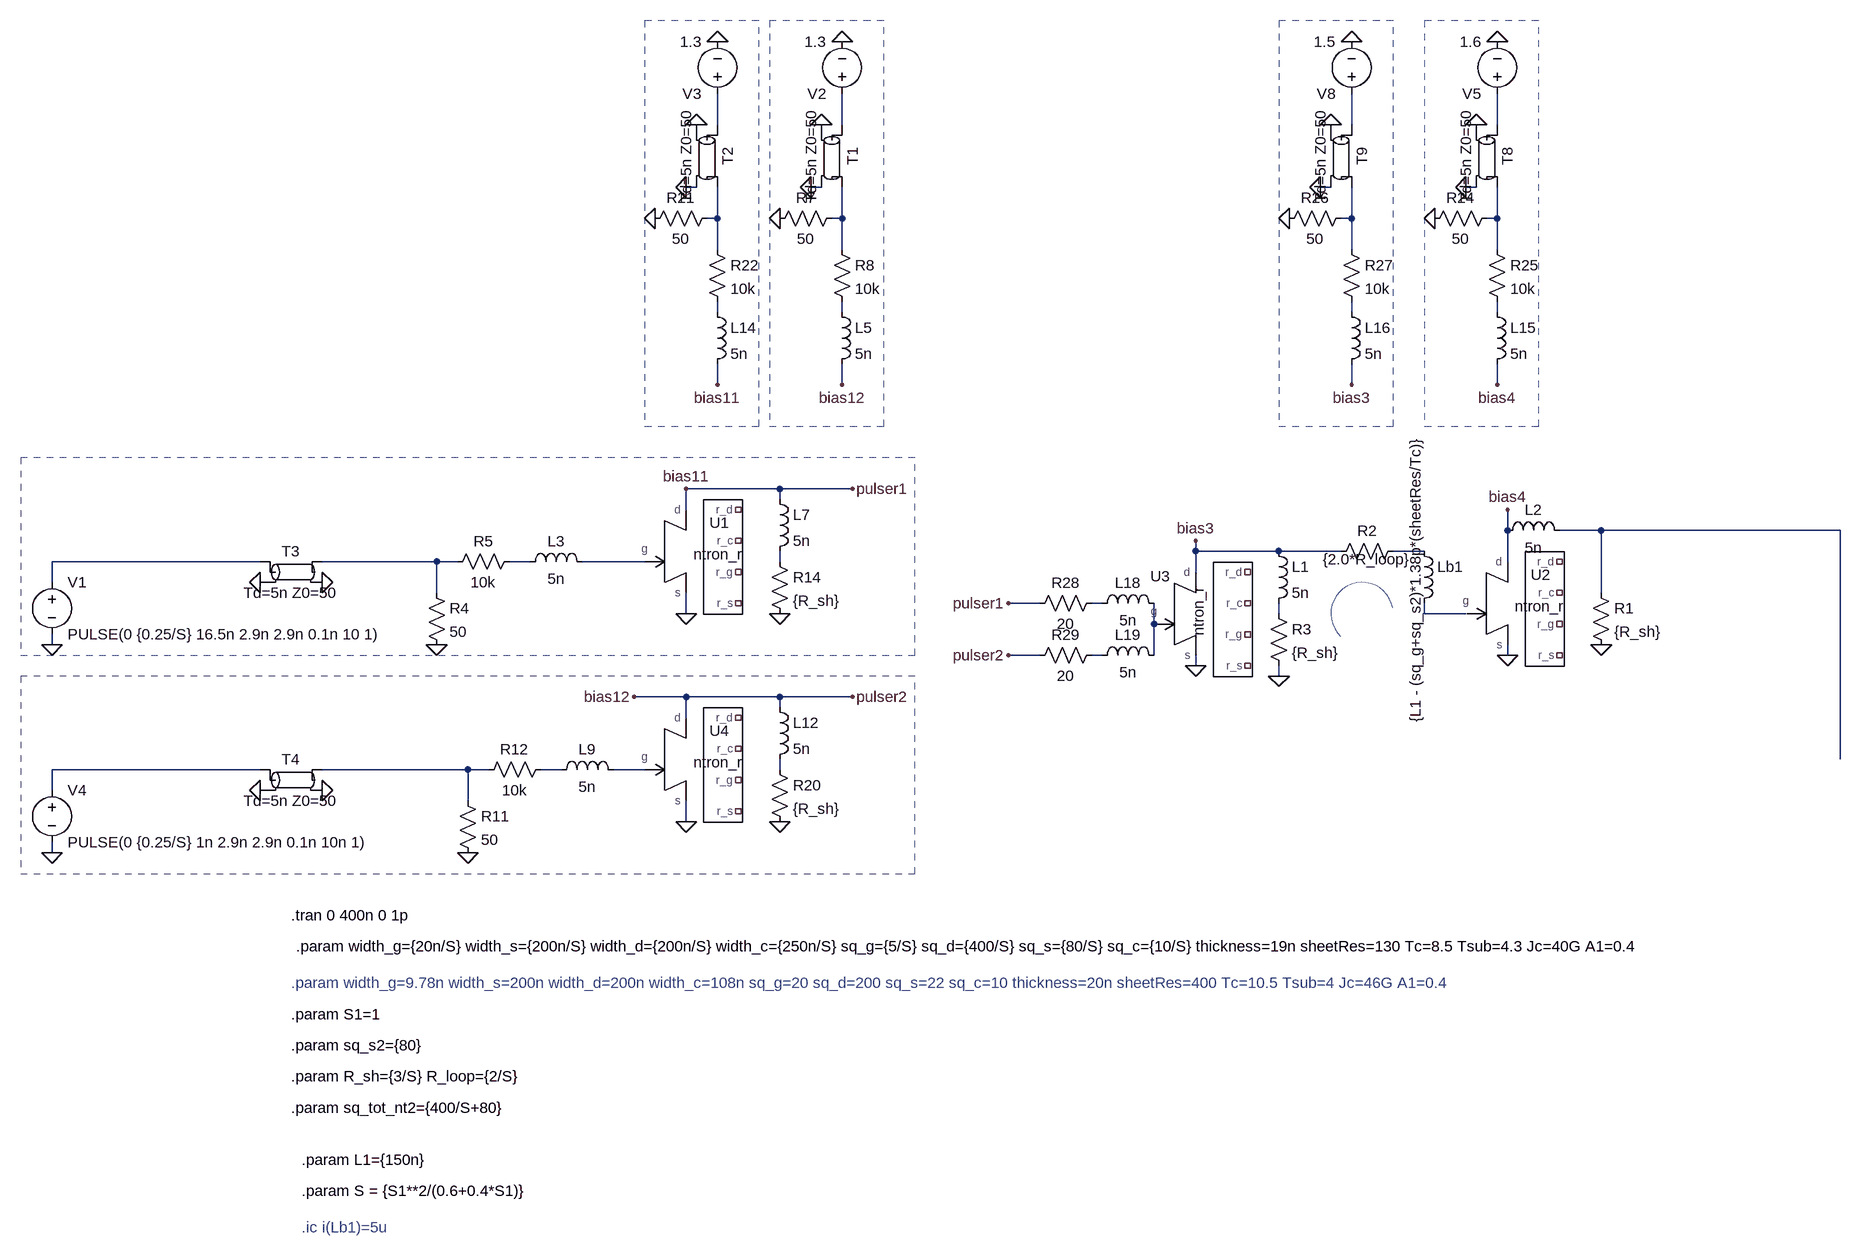
[diagram p0: schematic SNN_2input_single_transponder.asc]
SNN_2input_single_transponder.asc, the LTspice schematic file:
Version 4.1
SHEET 1 3684 2036
WIRE -1920 -1168 -1920 -1216
WIRE -1728 -1168 -1728 -1216
WIRE -944 -1168 -944 -1216
WIRE -720 -1168 -720 -1216
WIRE -1952 -1072 -1968 -1072
WIRE -1760 -1072 -1776 -1072
WIRE -976 -1072 -992 -1072
WIRE -752 -1072 -768 -1072
WIRE -1920 -1024 -1920 -1072
WIRE -1920 -1024 -1936 -1024
WIRE -1728 -1024 -1728 -1072
WIRE -1728 -1024 -1744 -1024
WIRE -944 -1024 -944 -1072
WIRE -944 -1024 -960 -1024
WIRE -720 -1024 -720 -1072
WIRE -720 -1024 -736 -1024
WIRE -1920 -976 -1920 -1024
WIRE -1728 -976 -1728 -1024
WIRE -944 -976 -944 -1024
WIRE -720 -976 -720 -1024
WIRE -1920 -880 -1920 -896
WIRE -1728 -880 -1728 -896
WIRE -944 -880 -944 -896
WIRE -720 -880 -720 -896
WIRE -1920 -768 -1920 -800
WIRE -1728 -768 -1728 -800
WIRE -944 -768 -944 -800
WIRE -720 -768 -720 -800
WIRE -1824 -608 -1968 -608
WIRE -1712 -608 -1824 -608
WIRE -1824 -592 -1824 -608
WIRE -1968 -576 -1968 -608
WIRE -704 -544 -704 -576
WIRE -560 -544 -624 -544
WIRE -192 -544 -560 -544
WIRE -1184 -512 -1184 -528
WIRE -1056 -512 -1184 -512
WIRE -960 -512 -1056 -512
WIRE -832 -512 -880 -512
WIRE -2624 -496 -2944 -496
WIRE -2352 -496 -2528 -496
WIRE -2320 -496 -2352 -496
WIRE -2208 -496 -2240 -496
WIRE -2032 -496 -2128 -496
WIRE -1824 -496 -1824 -512
WIRE -704 -496 -704 -544
WIRE -1184 -480 -1184 -512
WIRE -2944 -464 -2944 -496
WIRE -2352 -448 -2352 -496
WIRE -560 -448 -560 -544
WIRE -1424 -432 -1472 -432
WIRE -1328 -432 -1344 -432
WIRE -1968 -416 -1968 -448
WIRE -1056 -416 -1056 -432
WIRE -832 -416 -832 -432
WIRE -768 -416 -832 -416
WIRE -1248 -400 -1248 -432
WIRE -2944 -368 -2944 -384
WIRE -1424 -352 -1472 -352
WIRE -1328 -352 -1344 -352
WIRE -1248 -352 -1248 -400
WIRE -704 -352 -704 -368
WIRE -1184 -336 -1184 -352
WIRE -1056 -320 -1056 -336
WIRE -1968 -288 -2048 -288
WIRE -1824 -288 -1968 -288
WIRE -1712 -288 -1824 -288
WIRE -1824 -272 -1824 -288
WIRE -1968 -256 -1968 -288
WIRE -192 -192 -192 -544
WIRE -2624 -176 -2944 -176
WIRE -2304 -176 -2528 -176
WIRE -2272 -176 -2304 -176
WIRE -2160 -176 -2192 -176
WIRE -2032 -176 -2080 -176
WIRE -1824 -176 -1824 -192
WIRE -2944 -144 -2944 -176
WIRE -2304 -128 -2304 -176
WIRE -1968 -96 -1968 -128
WIRE -2944 -48 -2944 -64
FLAG -704 -352 0
FLAG -1056 -320 0
FLAG -2352 -368 0
FLAG -2944 -368 0
FLAG -2528 -464 0
FLAG -2624 -464 0
FLAG -1968 -416 0
FLAG -1824 -416 0
FLAG -2304 -48 0
FLAG -2944 -48 0
FLAG -2528 -144 0
FLAG -2624 -144 0
FLAG -1184 -336 0
FLAG -1968 -96 0
FLAG -1824 -96 0
FLAG -1712 -608 pulser1
FLAG -1712 -288 pulser2
FLAG -2048 -288 bias12
FLAG -816 -1024 0
FLAG -752 -1168 0
FLAG -768 -1072 0
FLAG -720 -1296 0
FLAG -720 -768 bias4
FLAG -1040 -1024 0
FLAG -976 -1168 0
FLAG -992 -1072 0
FLAG -944 -1296 0
FLAG -944 -768 bias3
FLAG -1184 -528 bias3
FLAG -704 -576 bias4
FLAG -560 -368 0
FLAG -1824 -1024 0
FLAG -1760 -1168 0
FLAG -1776 -1072 0
FLAG -1728 -1296 0
FLAG -1728 -768 bias12
FLAG -2016 -1024 0
FLAG -1952 -1168 0
FLAG -1968 -1072 0
FLAG -1920 -1296 0
FLAG -1920 -768 bias11
FLAG -1968 -608 bias11
FLAG -1472 -432 pulser1
FLAG -1472 -352 pulser2
SYMBOL ind -848 -528 R0
WINDOW 3 2 -165 VRight 2
SYMATTR Value {L1 - (sq_g+sq_s2)*1.38p*(sheetRes/Tc)}
SYMATTR InstName Lb1
SYMBOL ntron_r -704 -432 R0
WINDOW 39 2 131 Invisible 2
WINDOW 3 50 -11 Top 2
WINDOW 0 51 -28 Bottom 2
SYMATTR SpiceLine width_g={width_g} width_s={width_s} width_d={width_d} width_c={width_c} sq_g={sq_g} sq_d={sq_tot_nt2-sq_s2} sq_s={sq_s2} sq_c={sq_c} thickness={thickness} sheetRes={sheetRes} Tc={Tc} Tsub={Tsub} Jc={Jc} A1={A1}
SYMATTR InstName U2
SYMBOL res -1072 -432 R0
SYMATTR InstName R3
SYMATTR Value {R_sh}
SYMBOL ind -1072 -528 R0
SYMATTR InstName L1
SYMATTR Value 5n
SYMBOL res -2368 -464 R0
SYMATTR InstName R4
SYMATTR Value 50
SYMBOL res -2336 -480 R270
WINDOW 0 32 56 VTop 2
WINDOW 3 0 56 VBottom 2
SYMATTR InstName R5
SYMATTR Value 10k
SYMBOL ind -2224 -480 R270
WINDOW 0 32 56 VTop 2
WINDOW 3 5 56 VBottom 2
SYMATTR InstName L3
SYMATTR Value 5n
SYMBOL voltage -2944 -480 R0
WINDOW 123 0 0 Left 2
WINDOW 39 0 0 Left 2
SYMATTR InstName V1
SYMATTR Value PULSE(0 {0.25/S} 16.5n 2.9n 2.9n 0.1n 10 1)
SYMBOL tline -2576 -480 R0
SYMATTR InstName T3
SYMATTR Value Td=5n Z0=50
SYMBOL res -976 -496 R270
WINDOW 0 32 56 VTop 2
WINDOW 3 19 56 VBottom 2
SYMATTR InstName R2
SYMATTR Value {2.0*R_loop}
SYMBOL ntron_r -1184 -416 R0
WINDOW 39 2 131 Invisible 2
WINDOW 3 20 -4 VBottom 2
WINDOW 0 -54 -42 Bottom 2
SYMATTR SpiceLine width_g={width_g} width_s={width_s} width_d={width_d} width_c={width_c} sq_g=10 sq_d={sq_d} sq_s={sq_s} sq_c={sq_c} thickness={thickness} sheetRes={sheetRes} Tc={Tc} Tsub={Tsub} Jc={Jc} A1={A1}
SYMATTR InstName U3
SYMBOL res -1840 -512 R0
SYMATTR InstName R14
SYMATTR Value {R_sh}
SYMBOL ind -1840 -608 R0
SYMATTR InstName L7
SYMATTR Value 5n
SYMBOL ntron_r -1968 -512 R0
WINDOW 39 2 131 Invisible 2
WINDOW 3 50 -11 Top 2
WINDOW 0 51 -28 Bottom 2
SYMATTR SpiceLine width_g={width_g} width_s={width_s} width_d={width_d} width_c={width_c} sq_g=10 sq_d={sq_d} sq_s={sq_s} sq_c={sq_c} thickness={thickness} sheetRes={sheetRes} Tc={Tc} Tsub={Tsub} Jc={Jc} A1={A1}
SYMATTR InstName U1
SYMBOL res -2320 -144 R0
SYMATTR InstName R11
SYMATTR Value 50
SYMBOL res -2288 -160 R270
WINDOW 0 32 56 VTop 2
WINDOW 3 0 56 VBottom 2
SYMATTR InstName R12
SYMATTR Value 10k
SYMBOL ind -2176 -160 R270
WINDOW 0 32 56 VTop 2
WINDOW 3 5 56 VBottom 2
SYMATTR InstName L9
SYMATTR Value 5n
SYMBOL voltage -2944 -160 R0
WINDOW 123 0 0 Left 2
WINDOW 39 0 0 Left 2
SYMATTR InstName V4
SYMATTR Value PULSE(0 {0.25/S} 1n 2.9n 2.9n 0.1n 10n 1)
SYMBOL tline -2576 -160 R0
SYMATTR InstName T4
SYMATTR Value Td=5n Z0=50
SYMBOL res -1840 -192 R0
SYMATTR InstName R20
SYMATTR Value {R_sh}
SYMBOL ind -1840 -288 R0
SYMATTR InstName L12
SYMATTR Value 5n
SYMBOL ntron_r -1968 -192 R0
WINDOW 39 2 131 Invisible 2
WINDOW 3 50 -11 Top 2
WINDOW 0 51 -28 Bottom 2
SYMATTR SpiceLine width_g={width_g} width_s={width_s} width_d={width_d} width_c={width_c} sq_g=10 sq_d={sq_d} sq_s={sq_s} sq_c={sq_c} thickness={thickness} sheetRes={sheetRes} Tc={Tc} Tsub={Tsub} Jc={Jc} A1={A1}
SYMATTR InstName U4
SYMBOL tline -736 -1120 R90
SYMATTR InstName T8
SYMATTR Value Td=5n Z0=50
SYMBOL res -720 -1040 R90
WINDOW 0 0 56 VBottom 2
WINDOW 3 32 56 VTop 2
SYMATTR InstName R24
SYMATTR Value 50
SYMBOL res -736 -992 R0
SYMATTR InstName R25
SYMATTR Value 10k
SYMBOL ind -736 -896 R0
SYMATTR InstName L15
SYMATTR Value 5n
SYMBOL voltage -720 -1200 R180
WINDOW 123 0 0 Left 2
WINDOW 39 0 0 Left 2
SYMATTR InstName V5
SYMATTR Value 1.6
SYMBOL tline -960 -1120 R90
SYMATTR InstName T9
SYMATTR Value Td=5n Z0=50
SYMBOL res -944 -1040 R90
WINDOW 0 0 56 VBottom 2
WINDOW 3 32 56 VTop 2
SYMATTR InstName R26
SYMATTR Value 50
SYMBOL res -960 -992 R0
SYMATTR InstName R27
SYMATTR Value 10k
SYMBOL ind -960 -896 R0
SYMATTR InstName L16
SYMATTR Value 5n
SYMBOL voltage -944 -1200 R180
WINDOW 123 0 0 Left 2
WINDOW 39 0 0 Left 2
SYMATTR InstName V8
SYMATTR Value 1.5
SYMBOL ind -720 -528 R270
WINDOW 0 32 56 VTop 2
WINDOW 3 5 56 VBottom 2
SYMATTR InstName L2
SYMATTR Value 5n
SYMBOL res -576 -464 R0
SYMATTR InstName R1
SYMATTR Value {R_sh}
SYMBOL tline -1744 -1120 R90
SYMATTR InstName T1
SYMATTR Value Td=5n Z0=50
SYMBOL res -1728 -1040 R90
WINDOW 0 0 56 VBottom 2
WINDOW 3 32 56 VTop 2
SYMATTR InstName R7
SYMATTR Value 50
SYMBOL res -1744 -992 R0
SYMATTR InstName R8
SYMATTR Value 10k
SYMBOL ind -1744 -896 R0
SYMATTR InstName L5
SYMATTR Value 5n
SYMBOL voltage -1728 -1200 R180
WINDOW 123 0 0 Left 2
WINDOW 39 0 0 Left 2
SYMATTR InstName V2
SYMATTR Value 1.3
SYMBOL tline -1936 -1120 R90
SYMATTR InstName T2
SYMATTR Value Td=5n Z0=50
SYMBOL res -1920 -1040 R90
WINDOW 0 0 56 VBottom 2
WINDOW 3 32 56 VTop 2
SYMATTR InstName R21
SYMATTR Value 50
SYMBOL res -1936 -992 R0
SYMATTR InstName R22
SYMATTR Value 10k
SYMBOL ind -1936 -896 R0
SYMATTR InstName L14
SYMATTR Value 5n
SYMBOL voltage -1920 -1200 R180
WINDOW 123 0 0 Left 2
WINDOW 39 0 0 Left 2
SYMATTR InstName V3
SYMATTR Value 1.3
SYMBOL ind -1344 -416 R270
WINDOW 0 32 56 VTop 2
WINDOW 3 5 56 VBottom 2
SYMATTR InstName L18
SYMATTR Value 5n
SYMBOL res -1328 -448 R90
WINDOW 0 0 56 VBottom 2
WINDOW 3 32 56 VTop 2
SYMATTR InstName R28
SYMATTR Value 20
SYMBOL ind -1344 -336 R270
WINDOW 0 32 56 VTop 2
WINDOW 3 5 56 VBottom 2
SYMATTR InstName L19
SYMATTR Value 5n
SYMBOL res -1328 -368 R90
WINDOW 0 0 56 VBottom 2
WINDOW 3 32 56 VTop 2
SYMATTR InstName R29
SYMATTR Value 20
TEXT -2576 48 Left 2 !.tran 0 400n 0 1p
TEXT -2560 528 Left 2 ;.ic i(Lb1)=5u
TEXT -2568 96 Left 2 !.param width_g={20n/S} width_s={200n/S} width_d={200n/S} width_c={250n/S} sq_g={5/S} sq_d={400/S} sq_s={80/S} sq_c={10/S} thickness=19n sheetRes=130 Tc=8.5 Tsub=4.3 Jc=40G A1=0.4
TEXT -2576 296 Left 2 !.param R_sh={3/S} R_loop={2/S}
TEXT -2576 152 Left 2 ;.param width_g=9.78n width_s=200n width_d=200n width_c=108n sq_g=20 sq_d=200 sq_s=22 sq_c=10 thickness=20n sheetRes=400 Tc=10.5 Tsub=4 Jc=46G A1=0.4
TEXT -2576 248 Left 2 !.param sq_s2={80}
TEXT -2576 344 Left 2 !.param sq_tot_nt2={400/S+80}
TEXT -2560 424 Left 2 !.param L1={150n}
TEXT -2576 200 Left 2 !.param S1=1
TEXT -2560 472 Left 2 !.param S = {S1**2/(0.6+0.4*S1)}
RECTANGLE Normal -2992 -352 -1616 -656 2
RECTANGLE Normal -2992 -16 -1616 -320 2
RECTANGLE Normal -832 -704 -656 -1328 2
RECTANGLE Normal -1056 -704 -880 -1328 2
RECTANGLE Normal -1840 -704 -1664 -1328 2
RECTANGLE Normal -2032 -704 -1856 -1328 2
ARC Normal -976 -368 -880 -464 -859 -429 -963 -379 2

The netlist it stands for:
* SNN_2input_single_transponder.asc
Lb1 N014 N022 {L1 - (sq_g+sq_s2)*1.38p*(sheetRes/Tc)}
X§U2 N022 bias4 0 NC_01 NC_02 NC_03 NC_04 ntron_r ntron_r width_g={width_g} width_s={width_s} width_d={width_d} width_c={width_c} sq_g={sq_g} sq_d={sq_tot_nt2-sq_s2} sq_s={sq_s2} sq_c={sq_c} thickness={thickness} sheetRes={sheetRes} Tc={Tc} Tsub={Tsub} Jc={Jc} A1={A1}  ; pins g d s r_g r_d r_c r_s
R3 N021 0 {R_sh}
L1 bias3 N021 5n
R4 N016 0 50
R5 N016 N017 10k
L3 N017 N018 5n
V1 N015 0 PULSE(0 {0.25/S} 16.5n 2.9n 2.9n 0.1n 10 1)
T3 N015 0 N016 0 Td=5n Z0=50
R2 bias3 N014 {2.0*R_loop}
X§U3 N023 bias3 0 NC_05 NC_06 NC_07 NC_08 ntron_r ntron_r width_g={width_g} width_s={width_s} width_d={width_d} width_c={width_c} sq_g=10 sq_d={sq_d} sq_s={sq_s} sq_c={sq_c} thickness={thickness} sheetRes={sheetRes} Tc={Tc} Tsub={Tsub} Jc={Jc} A1={A1}  ; pins g d s r_g r_d r_c r_s
R14 N019 0 {R_sh}
L7 bias11 N019 5n
X§U1 N018 bias11 0 NC_09 NC_10 NC_11 NC_12 ntron_r ntron_r width_g={width_g} width_s={width_s} width_d={width_d} width_c={width_c} sq_g=10 sq_d={sq_d} sq_s={sq_s} sq_c={sq_c} thickness={thickness} sheetRes={sheetRes} Tc={Tc} Tsub={Tsub} Jc={Jc} A1={A1}  ; pins g d s r_g r_d r_c r_s
R11 N026 0 50
R12 N026 N027 10k
L9 N027 N028 5n
V4 N025 0 PULSE(0 {0.25/S} 1n 2.9n 2.9n 0.1n 10n 1)
T4 N025 0 N026 0 Td=5n Z0=50
R20 N029 0 {R_sh}
L12 bias12 N029 5n
X§U4 N028 bias12 0 NC_13 NC_14 NC_15 NC_16 ntron_r ntron_r width_g={width_g} width_s={width_s} width_d={width_d} width_c={width_c} sq_g=10 sq_d={sq_d} sq_s={sq_s} sq_c={sq_c} thickness={thickness} sheetRes={sheetRes} Tc={Tc} Tsub={Tsub} Jc={Jc} A1={A1}  ; pins g d s r_g r_d r_c r_s
T8 N004 0 N008 0 Td=5n Z0=50
R24 N008 0 50
R25 N008 N012 10k
L15 N012 bias4 5n
V5 N004 0 1.6
T9 N003 0 N007 0 Td=5n Z0=50
R26 N007 0 50
R27 N007 N011 10k
L16 N011 bias3 5n
V8 N003 0 1.5
L2 bias4 N013 5n
R1 N013 0 {R_sh}
T1 N002 0 N006 0 Td=5n Z0=50
R7 N006 0 50
R8 N006 N010 10k
L5 N010 bias12 5n
V2 N002 0 1.3
T2 N001 0 N005 0 Td=5n Z0=50
R21 N005 0 50
R22 N005 N009 10k
L14 N009 bias11 5n
V3 N001 0 1.3
L18 N020 N023 5n
R28 N020 bias11 20
L19 N024 N023 5n
R29 N024 bias12 20
.tran 0 400n 0 1p
* .ic i(Lb1)=5u
.param width_g={20n/S} width_s={200n/S} width_d={200n/S} width_c={250n/S} sq_g={5/S} sq_d={400/S} sq_s={80/S} sq_c={10/S} thickness=19n sheetRes=130 Tc=8.5 Tsub=4.3 Jc=40G A1=0.4
.param R_sh={3/S} R_loop={2/S}
* .param width_g=9.78n width_s=200n width_d=200n width_c=108n sq_g=20 sq_d=200 sq_s=22 sq_c=10 thickness=20n sheetRes=400 Tc=10.5 Tsub=4 Jc=46G A1=0.4
.param sq_s2={80}
.param sq_tot_nt2={400/S+80}
.param L1={150n}
.param S1=1
.param S = {S1**2/(0.6+0.4*S1)}
.lib ntron_2.lib
.backanno
.end